# Altium schematic sheet Overview.SchDoc
size A4; SheetNumber: 1; SheetTotal: 3
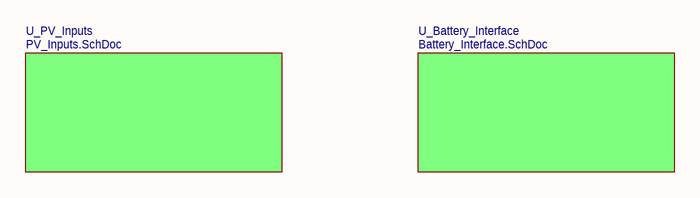
[diagram p0: Overview.SchDoc]

## Sub-sheets
U_Battery_Interface = Battery_Interface.SchDoc: no entries
U_PV_Inputs = PV_Inputs.SchDoc: no entries